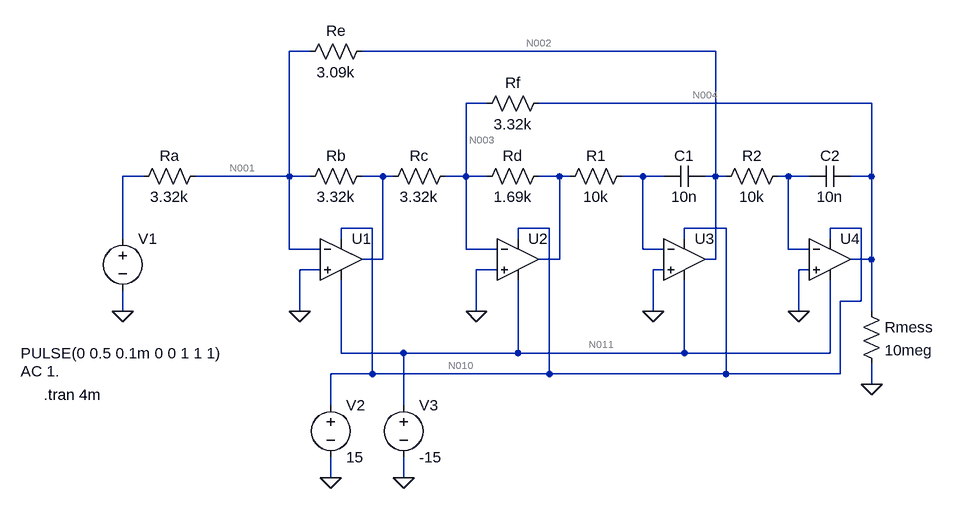
[diagram p0: schematic Schaltung_Sprungantwort.asc]
Schaltung_Sprungantwort.asc, the LTspice schematic file:
Version 4
SHEET 1 1312 680
WIRE 336 -240 304 -240
WIRE 960 -240 416 -240
WIRE 608 -160 576 -160
WIRE 1200 -160 688 -160
WIRE 80 -48 48 -48
WIRE 304 -48 304 -240
WIRE 304 -48 160 -48
WIRE 336 -48 304 -48
WIRE 448 -48 416 -48
WIRE 464 -48 448 -48
WIRE 576 -48 576 -160
WIRE 576 -48 544 -48
WIRE 608 -48 576 -48
WIRE 720 -48 688 -48
WIRE 736 -48 720 -48
WIRE 848 -48 816 -48
WIRE 880 -48 848 -48
WIRE 960 -48 960 -240
WIRE 960 -48 944 -48
WIRE 976 -48 960 -48
WIRE 1072 -48 1056 -48
WIRE 1104 -48 1072 -48
WIRE 1200 -48 1200 -160
WIRE 1200 -48 1168 -48
WIRE 432 32 384 32
WIRE 704 32 656 32
WIRE 976 32 912 32
WIRE 1184 32 1136 32
WIRE 48 48 48 -48
WIRE 384 48 384 32
WIRE 656 48 656 32
WIRE 912 48 912 32
WIRE 1136 48 1136 32
WIRE 304 64 304 -48
WIRE 352 64 304 64
WIRE 576 64 576 -48
WIRE 624 64 576 64
WIRE 848 64 848 -48
WIRE 880 64 848 64
WIRE 1072 64 1072 -48
WIRE 1104 64 1072 64
WIRE 448 80 448 -48
WIRE 448 80 416 80
WIRE 720 80 720 -48
WIRE 720 80 688 80
WIRE 960 80 960 -48
WIRE 960 80 944 80
WIRE 1200 80 1200 -48
WIRE 1200 80 1168 80
WIRE 352 96 320 96
WIRE 624 96 592 96
WIRE 880 96 864 96
WIRE 1104 96 1088 96
WIRE 1184 144 1184 32
WIRE 1184 144 1152 144
WIRE 48 160 48 128
WIRE 320 160 320 96
WIRE 592 160 592 96
WIRE 864 160 864 96
WIRE 1088 160 1088 96
WIRE 1200 160 1200 80
WIRE 384 224 384 112
WIRE 480 224 384 224
WIRE 656 224 656 112
WIRE 656 224 480 224
WIRE 912 224 912 112
WIRE 912 224 656 224
WIRE 1136 224 1136 112
WIRE 1136 224 912 224
WIRE 432 256 432 32
WIRE 432 256 368 256
WIRE 704 256 704 32
WIRE 704 256 432 256
WIRE 976 256 976 32
WIRE 976 256 704 256
WIRE 1152 256 1152 144
WIRE 1152 256 976 256
WIRE 1200 272 1200 240
WIRE 368 304 368 256
WIRE 480 304 480 224
WIRE 368 416 368 384
WIRE 480 416 480 384
FLAG 48 160 0
FLAG 320 160 0
FLAG 592 160 0
FLAG 864 160 0
FLAG 1088 160 0
FLAG 1200 272 0
FLAG 480 416 0
FLAG 368 416 0
SYMBOL voltage 48 32 R0
WINDOW 3 -157 192 Left 2
WINDOW 123 -157 220 Left 2
WINDOW 39 0 0 Left 2
SYMATTR InstName V1
SYMATTR Value PULSE(0 0.5 0.1m 0 0 1 1 1)
SYMATTR Value2 AC 1.
SYMBOL Opamps\\UniversalOpamp2 384 80 R0
SYMATTR InstName U1
SYMBOL Opamps\\UniversalOpamp2 656 80 R0
SYMATTR InstName U2
SYMBOL Opamps\\UniversalOpamp2 912 80 R0
SYMATTR InstName U3
SYMBOL Opamps\\UniversalOpamp2 1136 80 R0
SYMATTR InstName U4
SYMBOL res 176 -64 R90
WINDOW 0 0 56 VBottom 2
WINDOW 3 32 56 VTop 2
SYMATTR InstName Ra
SYMATTR Value 3.32k
SYMBOL res 432 -64 R90
WINDOW 0 0 56 VBottom 2
WINDOW 3 32 56 VTop 2
SYMATTR InstName Rb
SYMATTR Value 3.32k
SYMBOL res 560 -64 R90
WINDOW 0 0 56 VBottom 2
WINDOW 3 32 56 VTop 2
SYMATTR InstName Rc
SYMATTR Value 3.32k
SYMBOL res 704 -64 R90
WINDOW 0 0 56 VBottom 2
WINDOW 3 32 56 VTop 2
SYMATTR InstName Rd
SYMATTR Value 1.69k
SYMBOL res 832 -64 R90
WINDOW 0 0 56 VBottom 2
WINDOW 3 32 56 VTop 2
SYMATTR InstName R1
SYMATTR Value 10k
SYMBOL cap 944 -64 R90
WINDOW 0 0 32 VBottom 2
WINDOW 3 32 32 VTop 2
SYMATTR InstName C1
SYMATTR Value 10n
SYMBOL res 1072 -64 R90
WINDOW 0 0 56 VBottom 2
WINDOW 3 32 56 VTop 2
SYMATTR InstName R2
SYMATTR Value 10k
SYMBOL cap 1168 -64 R90
WINDOW 0 0 32 VBottom 2
WINDOW 3 32 32 VTop 2
SYMATTR InstName C2
SYMATTR Value 10n
SYMBOL res 704 -176 R90
WINDOW 0 0 56 VBottom 2
WINDOW 3 32 56 VTop 2
SYMATTR InstName Rf
SYMATTR Value 3.32k
SYMBOL res 432 -256 R90
WINDOW 0 0 56 VBottom 2
WINDOW 3 32 56 VTop 2
SYMATTR InstName Re
SYMATTR Value 3.09k
SYMBOL res 1184 144 R0
SYMATTR InstName Rmess
SYMATTR Value 10meg
SYMBOL voltage 368 288 R0
WINDOW 123 0 0 Left 2
WINDOW 39 0 0 Left 2
SYMATTR InstName V2
SYMATTR Value 15
SYMBOL voltage 480 288 R0
WINDOW 123 0 0 Left 2
WINDOW 39 0 0 Left 2
SYMATTR InstName V3
SYMATTR Value -15
TEXT -74 288 Left 2 !.tran 4m

The netlist it stands for:
* Schaltung_Sprungantwort.asc
V1 N005 0 PULSE(0 0.5 0.1m 0 0 1 1 1) AC 1.
XU1 0 N001 N010 N011 N006 level.2 Avol=1Meg GBW=10Meg Slew=10Meg ilimit=25m rail=0 Vos=0 phimargin=45 en=0 enk=0 in=0 ink=0 Rin=500Meg  ; pins IN+ IN- V+ V- OUT
XU2 0 N003 N010 N011 N007 level.2 Avol=1Meg GBW=10Meg Slew=10Meg ilimit=25m rail=0 Vos=0 phimargin=45 en=0 enk=0 in=0 ink=0 Rin=500Meg  ; pins IN+ IN- V+ V- OUT
XU3 0 N008 N010 N011 N002 level.2 Avol=1Meg GBW=10Meg Slew=10Meg ilimit=25m rail=0 Vos=0 phimargin=45 en=0 enk=0 in=0 ink=0 Rin=500Meg  ; pins IN+ IN- V+ V- OUT
XU4 0 N009 N010 N011 N004 level.2 Avol=1Meg GBW=10Meg Slew=10Meg ilimit=25m rail=0 Vos=0 phimargin=45 en=0 enk=0 in=0 ink=0 Rin=500Meg  ; pins IN+ IN- V+ V- OUT
Ra N001 N005 3.32k
Rb N006 N001 3.32k
Rc N003 N006 3.32k
Rd N007 N003 1.69k
R1 N008 N007 10k
C1 N002 N008 10n
R2 N009 N002 10k
C2 N004 N009 10n
Rf N004 N003 3.32k
Re N002 N001 3.09k
Rmess N004 0 10meg
V2 N010 0 15
V3 N011 0 -15
.tran 4m
.lib UniversalOpamps2.sub
.backanno
.end

* Results of the author's LTspice run, read from the files saved beside the schematic
* Operating Point, zero values left out:
*   V(n010) = 15 V
*   V(n011) = -15 V
*   I(V3) = 5.993 mA
*   I(V2) = -5.993 mA
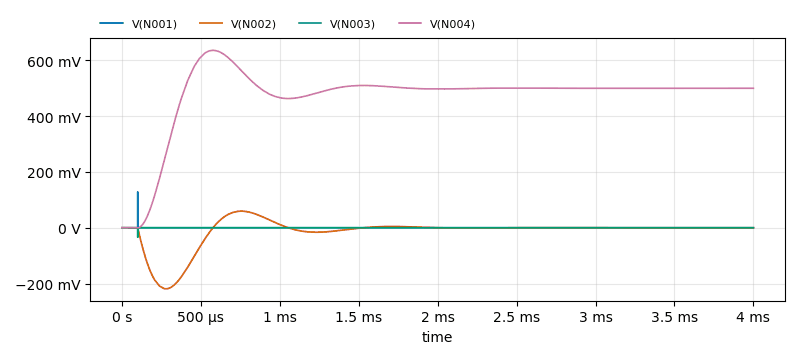
[diagram p1: Transient Analysis of Schaltung_Sprungantwort.asc, plotted from the saved traces]
* Transient Analysis, 1 run:
*   V(N001): min -45.47 µV, max 128.6 mV, average 2.621 µV, rms 398.8 µV, last 502.5 nV
*   V(N002): min -218.9 mV, max 59.48 mV, average -12.49 mV, rms 53.95 mV, last -5.338 µV
*   V(N003): min -33.96 mV, max 25.5 µV, average -37.4 nV, rms 157.3 µV, last 0 V
*   V(N004): min -30.4 µV, max 635.8 mV, average 474 mV, rms 489.3 mV, last 500 mV